# EasyEDA Pro project homeKit_HumC.eprj

# Schematic Schematic1
Create Date: 2022-08-31; Page Name: P1; Project Name: homeKit_HumC; Schematic Name: Schematic1; Update Date: 2022-09-09; Company: 嘉立创EDA
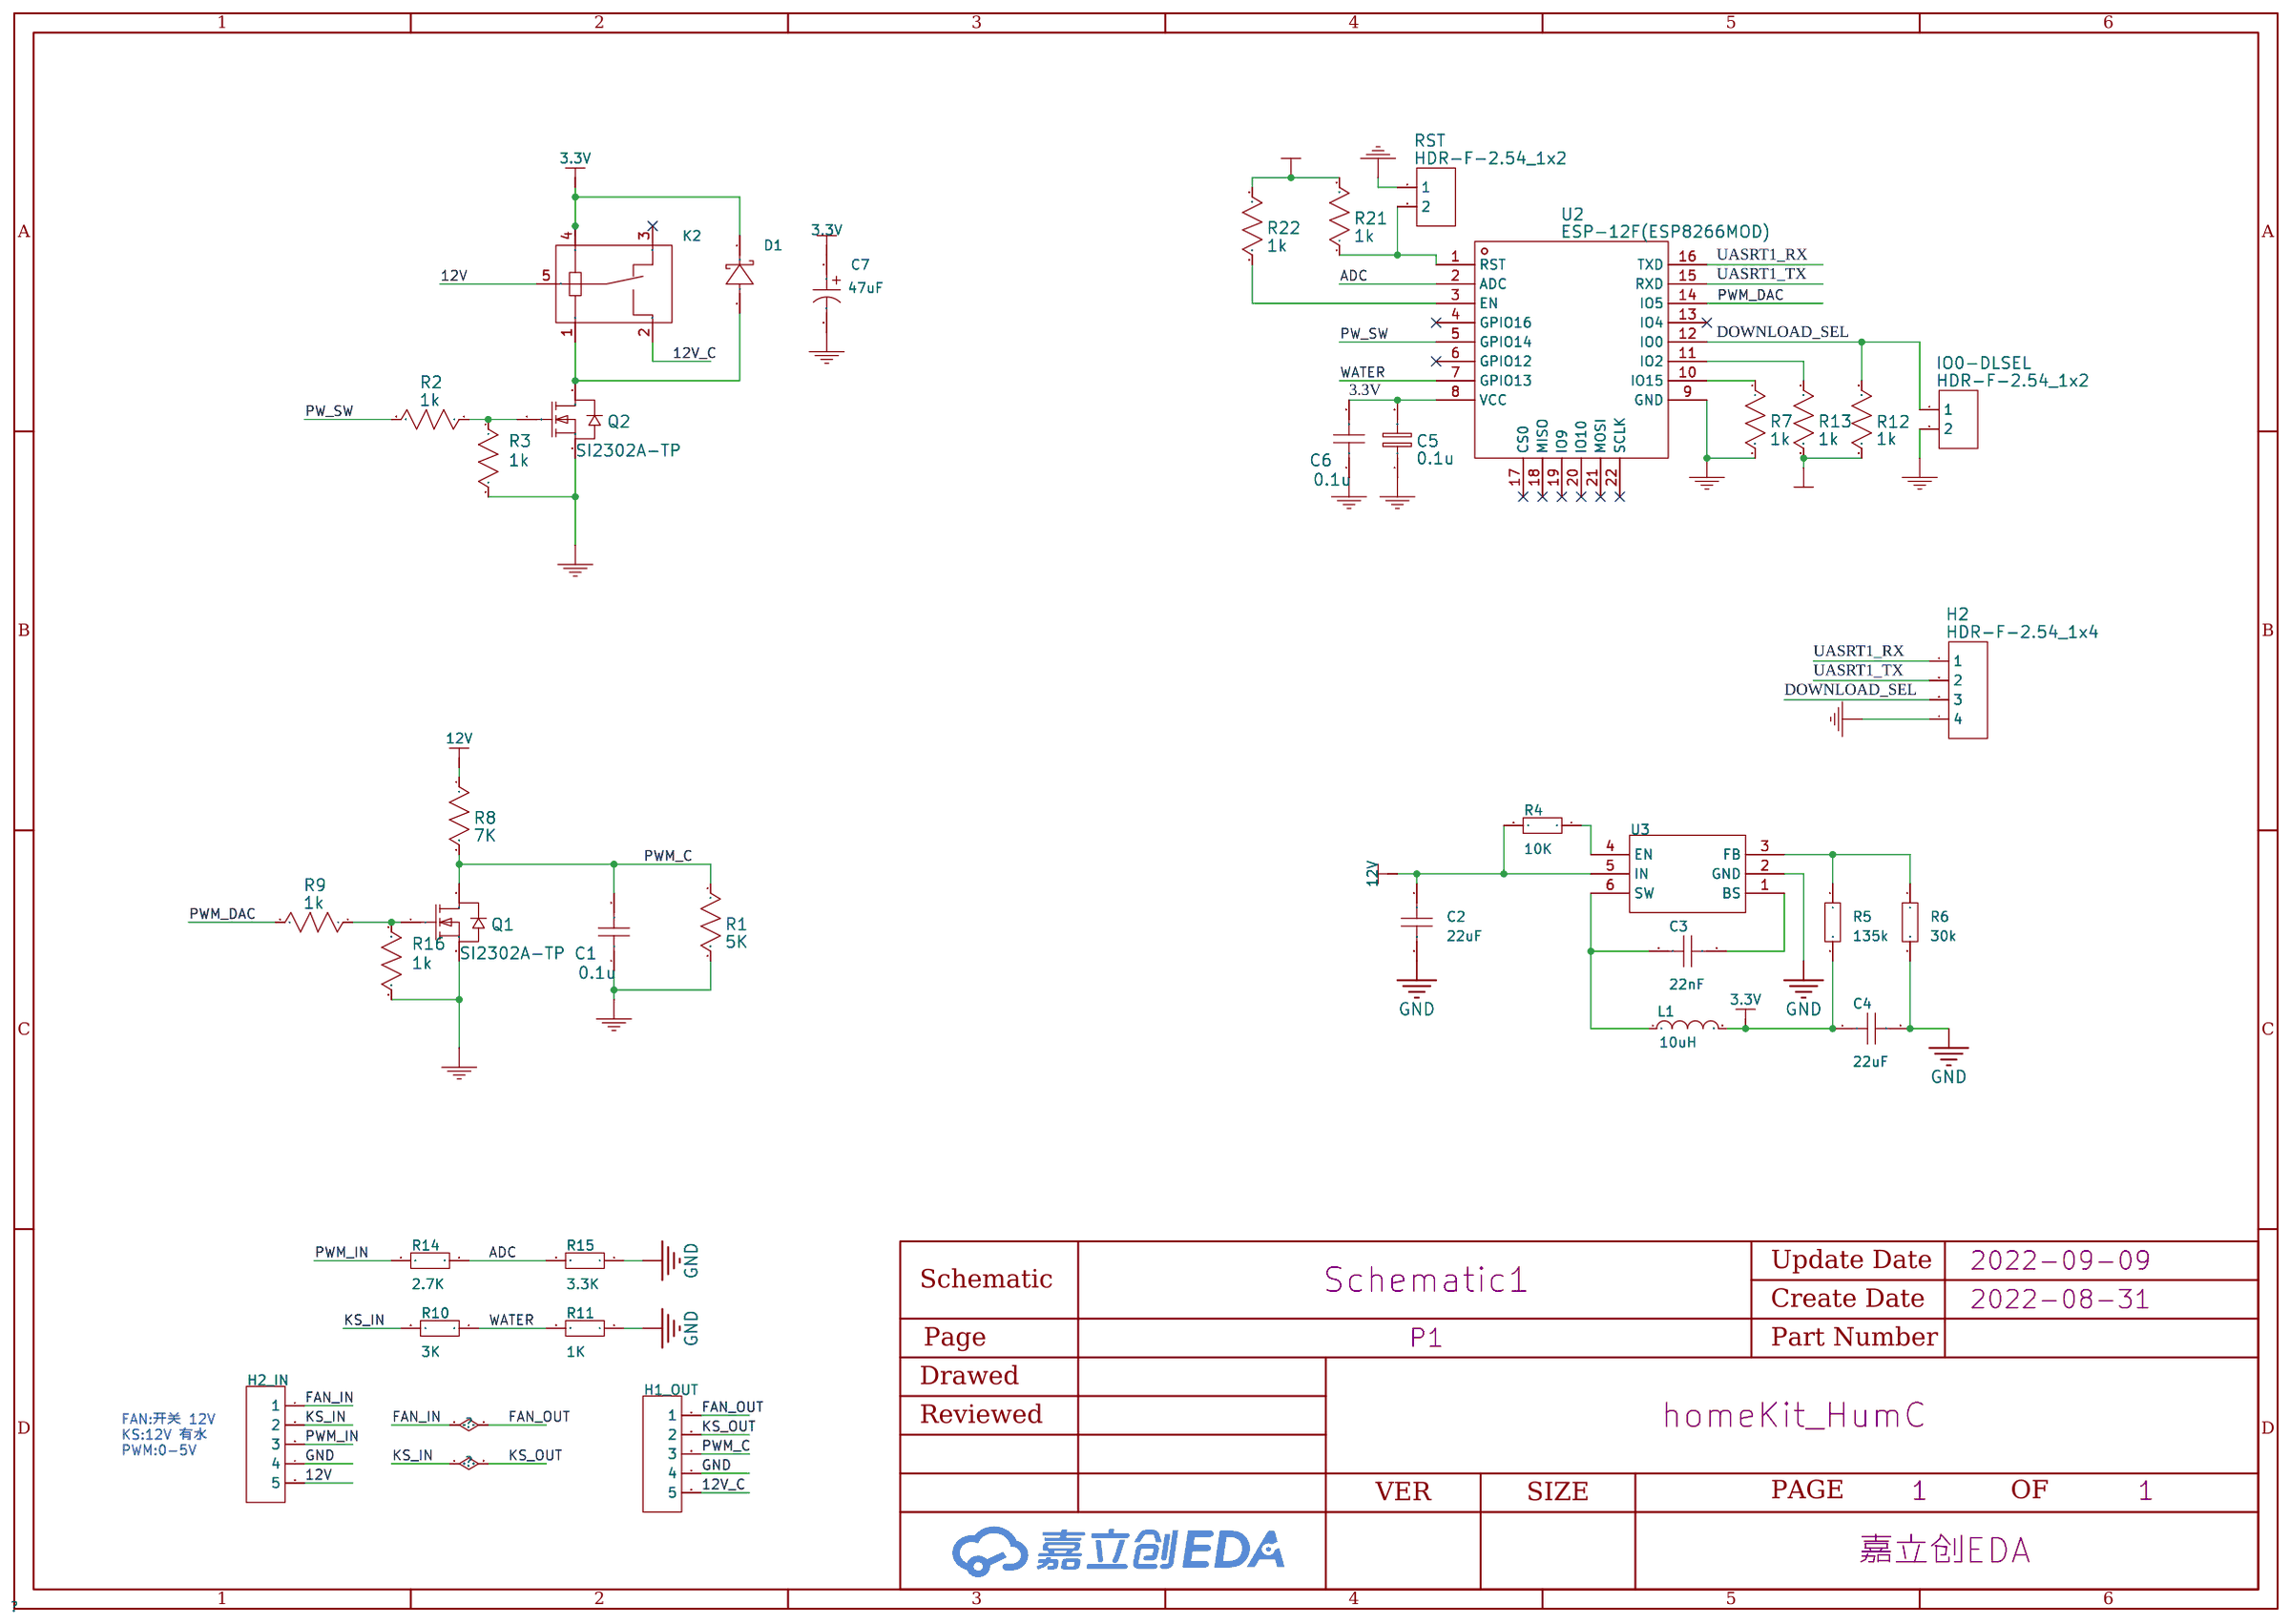
[diagram p0: schematic sheet]

## Parts
C1  0.1u  [C0805]
C2  22uF  [C0805]
C3  22nF  [C0603]
C4  22uF  [C0805]
C5  0.1u  [C0805]
C6  0.1u  [C0603]
C7  47uF  [CAP-TH_BD5.0-P2.00-D0.5-FD-1]
D1  SS34  [SMB_L4.3-W3.6-LS5.4-RD]
H1_OUT  -  [HDR-TH_5P-P2.54-V-F]
H2  HDR-F-2.54_1x4  [HDR-F-2.54_1X4]
H2_IN  -  [HDR-TH_5P-P2.54-V-F]
IO0-DLSEL  HDR-F-2.54_1x2  [HDR-F-2.54_1X2]
K2  HF3F-L/5-1ZL1T  [RELAY-TH_HF3F-L-12-1ZL1T]
L1  10uH  [IND-SMD_L7.4-W6.6]
Q1  SI2302A-TP  [SOT-23-3_L2.9-W1.3-P1.90-LS2.4-BR]
Q2  SI2302A-TP  [SOT-23-3_L2.9-W1.3-P1.90-LS2.4-BR]
R1  5K  [R0603]
R2  1k  [R0603]
R3  1k  [R0603]
R4  10K  [R0603]
R5  135k  [R0603]
R6  30k  [R0603]
R7  1k  [R0603]
R8  7K  [R0603]
R9  1k  [R0603]
R10  3K  [R0603]
R11  1K  [R0603]
R12  1k  [R0603]
R13  1k  [R0603]
R14  2.7K  [R0603]
R15  3.3K  [R0603]
R16  1k  [R0603]
R21  1k  [R0603]
R22  1k  [R0603]
RST  HDR-F-2.54_1x2  [HDR-F-2.54_1X2]
U2  ESP-12F(ESP8266MOD)  [WIFIM-SMD_ESP-12F-ESP8266MOD]
U3  MT2492  [SOT-23-6_L2.9-W1.6-P0.95-LS2.8-BR]

## Library data of the parts
C1 C5 C6 = 0.1u
C2 C4 = CAP_0805: 容值:100nF;精度:±10%;额定电压:50V;温度系数:X7R;; Supplier Footprint: 0805
C3 = CAP_0603: 容值:100nF;精度:±10%;额定电压:50V;温度系数:X7R;; Supplier Footprint: 0603
C7 = RA3-25V470ME3#-T58: 容值:47uF;精度:±20%;额定电压:25V;电容体直径:5mm;电容体长度:11mm;脚间距:2mm;纹波电流:130mA@120kHz;等效串联电阻:-;工作寿命:2000hrs@85;工作温度:-40~+85;; LCSC Part Name: 47uF ±20% 25V; Supplier Part: C2803545; Manufacturer: ELNA(伊娜); Supplier Footprint: 直插,D5xL11mm; Datasheet: https://atta.szlcsc.com/upload/public/pdf/source/20190620/C399580_30DA3C9088583F927B075350470E24E5.pdf; Supplier: LCSC; Tolerance: ±20%; Rated Voltage: 25V; φD: 5mm; L: 11mm; Lead Spacing: 2mm; Ripple Current: 130mA@120kHz; Lifetime @ Temp: 2000hrs@85; Operating Temperature: -40~+85
D1 = SS34_2: 二极管配置:-;直流反向耐压(Vr):40V;平均整流电流(Io):3A;正向压降(Vf):550mV@3A;反向电流(Ir):200uA@40V;; LCSC Part Name: 40V 3A 550mV@3A SMB; Supplier Part: C2758511; Manufacturer: UMW(友台半导体); Supplier Footprint: SMB; JLCPCB Part Class: 扩展库; Datasheet: https://atta.szlcsc.com/upload/public/pdf/source/20220418/6086AA90A55CA3573883AB8621B89826.pdf; Supplier: LCSC; Reverse Voltage (Vr): 40V; Average Rectified Current (Io): 3A; Forward Voltage (Vf@If): 550mV@3A; Reverse Leakage Current (Ir): 200uA@40V
H1_OUT H2_IN = HDR-F_2.54_1x5P: Supplier Part: C50950; Supplier Footprint: 插件
H2 = HDR-F-2.54_1x4: Supplier Part: C225501; Supplier: LCSC
IO0-DLSEL RST = HDR-F-2.54_1x2: Supplier Part: C49661; Supplier: LCSC
K2 = HF3F-L/5-1ZL1T: Supplier Part: C2690189; Manufacturer: HF(宏发); Supplier Footprint: 插件; JLCPCB Part Class: 扩展库; Datasheet: https://atta.szlcsc.com/upload/public/pdf/source/20210201/C2690189_3EE47653CE9FE2AFB2559E3194438A67.pdf; Supplier: LCSC
L1 = CKST0603-10uH/M: 电感值:10uH;精度:±20%;额定电流:4A;饱和电流(Isat):5A;直流电阻(DCR):68mΩ;; LCSC Part Name: 10uH ±20% 4A 68mΩ; Supplier Part: C3002639; Manufacturer: CENKER(岑科); Supplier Footprint: SMD,7.4x6.6x3mm; JLCPCB Part Class: 扩展库; Datasheet: https://atta.szlcsc.com/upload/public/pdf/source/20220510/B48FE89972EB9627500571FF6CB43AFA.pdf; Supplier: LCSC; Tolerance: ±20%; Rated Current: 4A; Saturation Current (Isat): 5A; DC Resistance (DCR): 68mΩ
Q1 Q2 = SI2302A-TP: Supplier: LCSC; Supplier Part: C668996; Manufacturer: MCC(Micro Commercial Components); JLCPCB Part Class: Extended Part
R1-R3 R7-R9 R12 R13 R16 R21 R22 = 1k
R4-R6 R10 R11 R14 R15 = Res_0603: Supplier Footprint: 0603
U2 = ESP-12F(ESP8266MOD): Supplier: LCSC; Manufacturer: Ai-Thinker; Supplier Part: C82891; JLCPCB Part Class: Extended Part
U3 = MT2492: 功能类型:降压型;同步整流:-;输出通道数:-;拓扑结构:-;输入电压:-;输出电流(最大值):-;开关频率:-;; LCSC Part Name: 降压型; Supplier Part: C89358; Manufacturer: 西安航天民芯; Supplier Footprint: SOT-23-6; JLCPCB Part Class: 扩展库; Datasheet: https://atta.szlcsc.com/upload/public/pdf/source/20170628/1498635304645.pdf; Supplier: LCSC; Function: 降压型

## Nets
3.3V: C4.1 C5.2 C6.2 C7.1 D1.1(K) K2.4 L1.2 R5.2 R12.1 R13.2 R21.2 R22.2 U2.8(VCC)
12V: C2.1 H2_IN.5 K2.5 R4.2 R8.1 U3.5(IN)
12V_C: H1_OUT.5 K2.2
GND: C1.1 C2.2 C4.2 C5.1 C6.1 C7.2 H1_OUT.4 H2.4 H2_IN.4 IO0-DLSEL.2 Q1.2(S) Q2.2(S) R1.2 R3.2 R6.2 R7.2 R11.1 R15.1 R16.2 RST.1 U2.9(GND) U3.2(GND)
ADC: R14.1 R15.2 U2.2(ADC)
DOWNLOAD_SEL: H2.3 IO0-DLSEL.1 R12.2 U2.12(IO0)
FAN_IN: H1_OUT.1 H2_IN.1
KS_IN: H1_OUT.2 H2_IN.2 R10.2
PW_SW: R2.2 U2.5(GPIO14)
PWM_C: C1.2 H1_OUT.3 Q1.3(D) R1.1 R8.2
PWM_DAC: R9.2 U2.14(IO5)
PWM_IN: H2_IN.3 R14.2
UASRT1_RX: H2.1 U2.16(TXD)
UASRT1_TX: H2.2 U2.15(RXD)
WATER: R10.1 R11.2 U2.7(GPIO13)
$1N1599: R4.1 U3.4(EN)
$1N2130: C3.2 L1.1 U3.6(SW)
$1N2166: C3.1 U3.1(BS)
$1N2356: R5.1 R6.1 U3.3(FB)
$1N4413: R7.1 U2.10(IO15)
$1N4419: R21.1 RST.2 U2.1(RST)
$1N4420: R22.1 U2.3(EN)
$1N4422: R13.1 U2.11(IO2)
$1N6965: Q1.1(G) R9.1 R16.1
$1N12731: Q2.1(G) R2.1 R3.1
$1N13895: D1.2(A) K2.1 Q2.3(D)

Not connected (* = marked no-connect by the designer): K2 3*; U2 4(GPIO16)* 6(GPIO12)* 13(IO4)* 17(CS0)* 18(MISO)* 19(IO9)* 20(IO10)* 21(MOSI)* 22(SCLK)*

## Notes on the sheet
- FAN:开关 12V
  KS:12V 有水
  PWM:0-5V

# Board PCB1
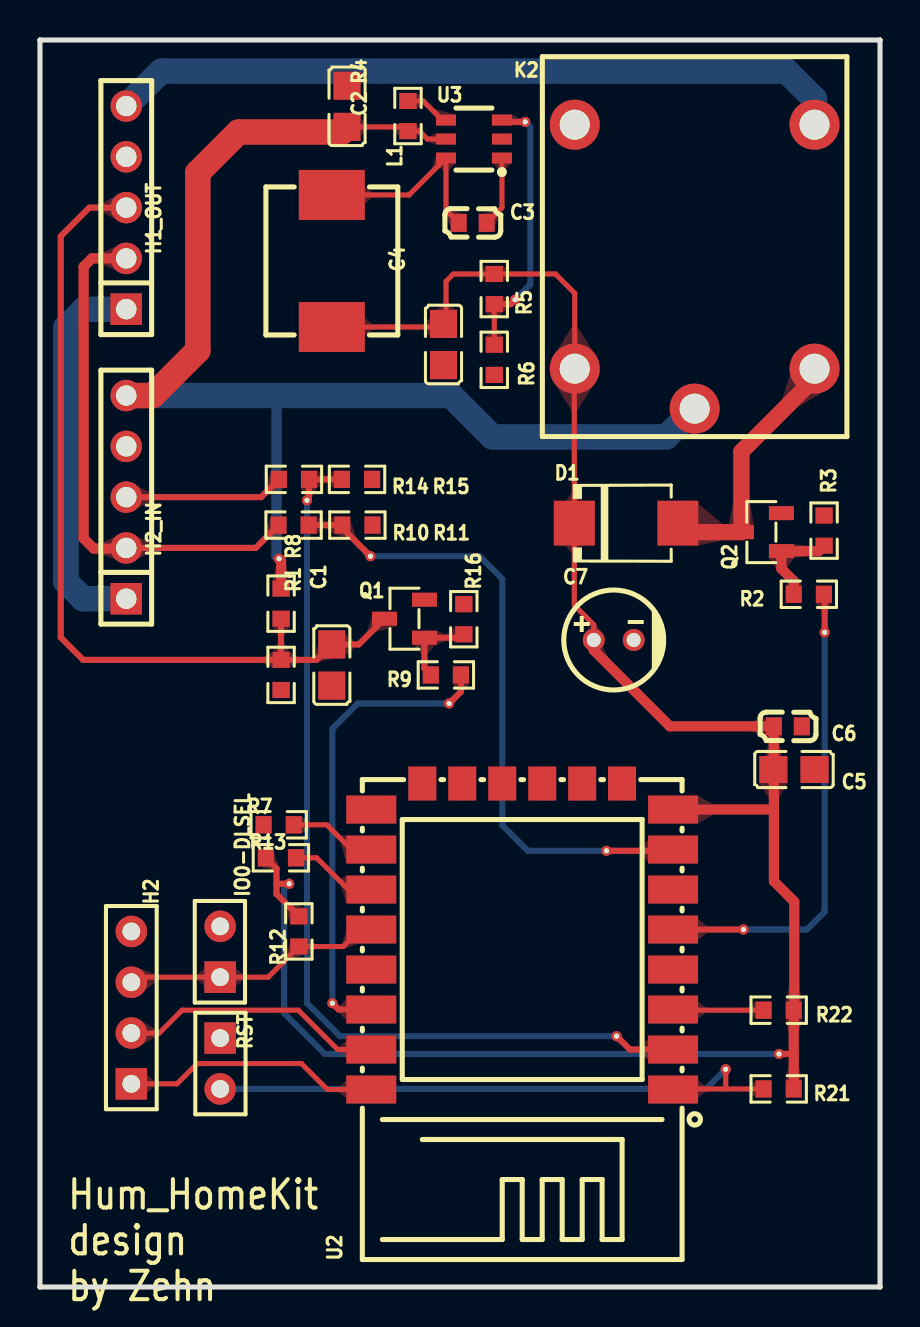
[diagram p1: board, top side]
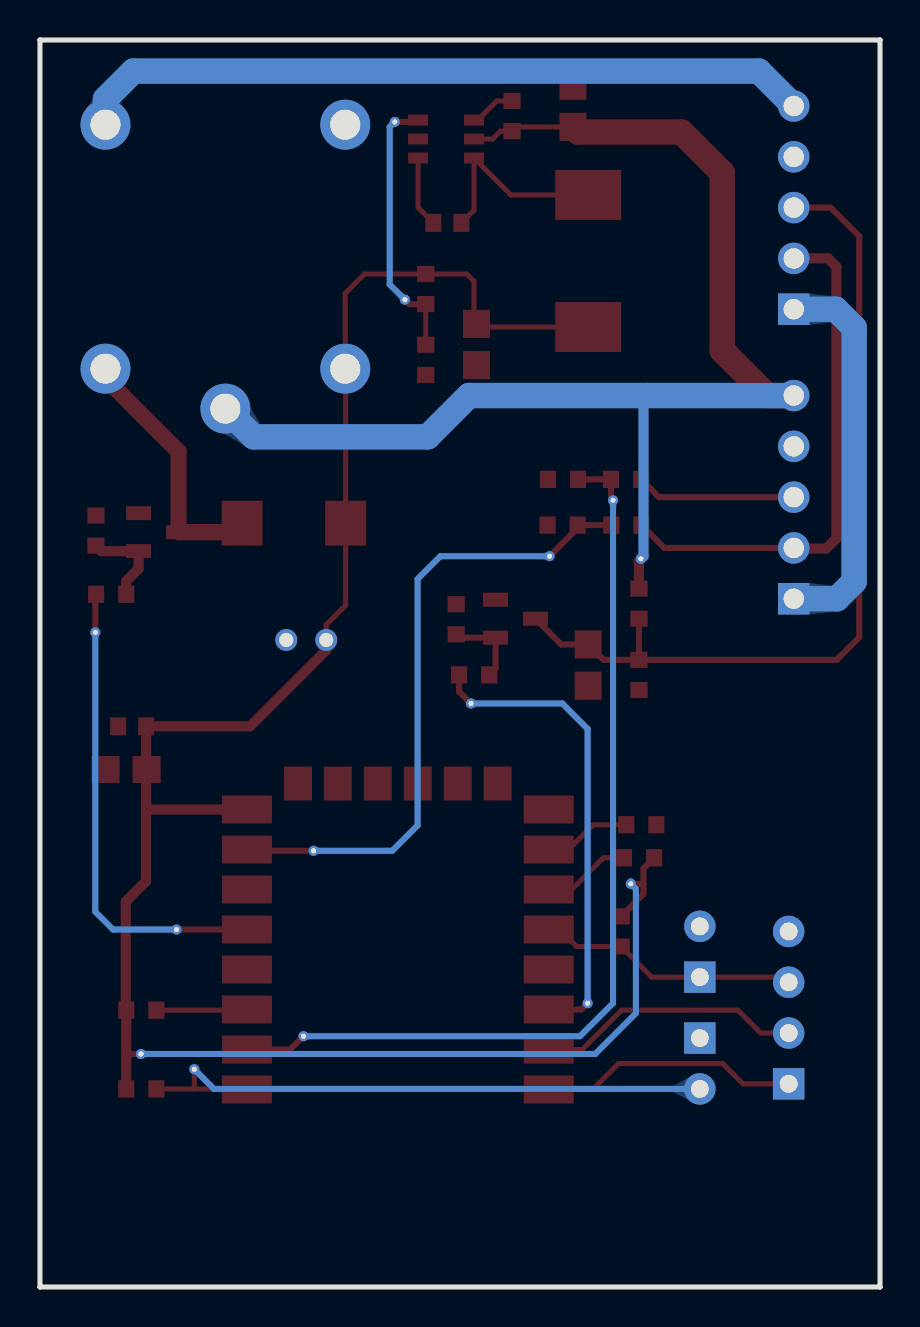
[diagram p2: board, bottom side, seen from below]

Outline 42.04 x 62.36 mm; copper layers: Top Layer, Bottom Layer. Coordinates in mm from the lower left corner of the outline.
Outline path: 0,62.35 0,0 arc(0,0) 0,0 42.03,0 arc(42.04,0) 42.04,0 42.04,62.35 arc(42.04,62.36) 42.03,62.36 0,62.36 arc(0,62.36) 0,62.35
Stack: Top Layer 0.035mm / Dielectric1 1.51mm FR4 er 4.5 / Bottom Layer 0.035mm

## Design rules (mm)
spacing safeClearance (default): track to track 0.152, other pairs 0.152 to 0.3
track width trackWidth (default): min 0.127, default 0.254, max 2.54
differential pair differentialPair (default): width min 0.127, default 0.254, max 2.54; gap min 0.152, default 0.152
via viaSize (default): diameter min 0.5, default 0.61, max 10; hole min 0.3, default 0.305, max 6
net 12V uses power
net GND uses GND
net $1N2166 uses power
net $1N1599 uses power
pour e104 uses GND

## Placement (name value [footprint] x y rotation side)
C1  0.1u  [C0805]  14.61 31.1 90 top
C2  22uF  [C0805]  15.37 59.04 90 top
C3  22nF  [C0603]  21.65 53.21 180 top
C4  22uF  [C0805]  20.19 47.13 270 top
C5  0.1u  [C0805]  37.73 25.88 180 top
C6  0.1u  [C0603]  37.42 28.04 180 top
C7  47uF  [CAP-TH_BD5.0-P2.00-D0.5-FD-1]  28.71 32.35 0 top
D1  SS34  [SMB_L4.3-W3.6-LS5.4-RD]  29.33 38.2 0 top
H1_OUT  -  [HDR-TH_5P-P2.54-V-F]  4.32 53.98 90 top
H2  HDR-F-2.54_1x4  [HDR-F-2.54_1X4]  4.57 13.97 90 top
H2_IN  -  [HDR-TH_5P-P2.54-V-F]  4.32 39.5 90 top
IO0-DLSEL  HDR-F-2.54_1x2  [HDR-F-2.54_1X2]  9.02 16.76 90 top
K2  HF3F-L/5-1ZL1T  [RELAY-TH_HF3F-L-12-1ZL1T]  32.76 51.02 90 top
L1  10uH  [IND-SMD_L7.4-W6.6]  14.61 51.31 270 top
NOREF  -  [Pad_e838]  11.96 36.42 0 top
NOREF#2  -  [Pad_e771]  36.98 11.65 0 top
NOREF#3  -  [Pad_e41]  20.47 29.18 0 top
NOREF#4  -  [Pad_e12]  24.28 58.26 0 top
NOREF#5  -  [Pad_e3]  23.77 49.37 0 top
NOREF#6  -  [Pad_e35]  14.63 14.19 0 top
NOREF#7  -  [Pad_e898]  28.85 12.54 0 top
NOREF#8  -  [Pad_e607]  12.47 20.16 0 top
NOREF#9  -  [Pad_e949]  39.27 32.73 0 top
NOREF#10  -  [Pad_e944]  35.2 17.88 0 top
NOREF#11  -  [Pad_e50]  16.54 36.54 0 top
NOREF#12  -  [Pad_e57]  28.35 21.81 0 top
NOREF#13  -  [Pad_e865]  34.32 10.89 0 top
NOREF#14  -  [Pad_e889]  13.36 39.34 0 top
Q1  SI2302A-TP  [SOT-23-3_L2.9-W1.3-P1.90-LS2.4-BR]  18.24 33.42 0 top
Q2  SI2302A-TP  [SOT-23-3_L2.9-W1.3-P1.90-LS2.4-BR]  36.1 37.75 0 top
R1  5K  [R0603]  12.07 30.61 270 top
R2  1k  [R0603]  38.47 34.64 0 top
R3  1k  [R0603]  39.24 37.82 90 top
R4  10K  [R0603]  18.42 58.56 270 top
R5  135k  [R0603]  22.73 49.9 90 top
R6  30k  [R0603]  22.73 46.36 270 top
R7  1k  [R0603]  11.95 23.11 180 top
R8  7K  [R0603]  12.07 34.17 270 top
R9  1k  [R0603]  20.31 30.61 0 top
R10  3K  [R0603]  12.69 38.1 180 top
R11  1K  [R0603]  15.88 38.1 180 top
R12  1k  [R0603]  12.95 17.78 270 top
R13  1k  [R0603]  12.06 21.46 180 top
R14  2.7K  [R0603]  12.71 40.39 180 top
R15  3.3K  [R0603]  15.87 40.39 180 top
R16  1k  [R0603]  21.21 33.39 90 top
R21  1k  [R0603]  36.97 9.91 0 top
R22  1k  [R0603]  36.97 13.84 0 top
RST  HDR-F-2.54_1x2  [HDR-F-2.54_1X2]  9.02 11.18 270 top
U2  ESP-12F(ESP8266MOD)  [WIFIM-SMD_ESP-12F-ESP8266MOD]  24.13 17.53 90 top
U3  MT2492  [SOT-23-6_L2.9-W1.6-P0.95-LS2.8-BR]  21.72 57.4 0 top

## Footprints (pads in the part's own frame, mm; a bottom-side part is the same pattern mirrored in y, then rotated)
C0603
  rect 0.8x0.9 smd: 1(-0.7,0) 2(0.7,0)
C0805
  rect 1.41x1.35 smd: 1(-1.03,0) 2(1.03,0)
CAP-TH_BD5.0-P2.00-D0.5-FD-1
  round 1.1 hole 0.7: 1(-1,0) 2(1,0)
HDR-F-2.54_1X2
  rect 1.575x1.575 hole 0.889: 1(-1.27,0)
  round 1.575 hole 0.889: 2(1.27,0)
HDR-F-2.54_1X4
  rect 1.575x1.575 hole 0.889: 1(-3.81,0)
  round 1.575 hole 0.889: 2(-1.27,0) 3(1.27,0) 4(3.81,0)
HDR-TH_5P-P2.54-V-F
  rect 1.575x1.575 hole 1.02: 1(-5.08,0)
  round 1.575 hole 1.02: 2(-2.54,0) 3(0,0) 4(2.54,0) 5(5.08,0)
IND-SMD_L7.4-W6.6
  rect 2.499x3.3 smd: 1(-3.302,0) 2(3.302,0)
Pad_e3
  round 0.508 hole 0.254: 1(0,0)
Pad_e12
  round 0.508 hole 0.254: 2(0,0)
Pad_e35
  round 0.508 hole 0.254: 3(0,0)
Pad_e41
  round 0.508 hole 0.254: 4(0,0)
Pad_e50
  round 0.508 hole 0.254: 5(0,0)
Pad_e57
  round 0.508 hole 0.254: 6(0,0)
Pad_e607
  round 0.508 hole 0.254: 1(0,0)
Pad_e771
  round 0.508 hole 0.254: 2(0,0)
Pad_e838
  round 0.508 hole 0.254: 3(0,0)
Pad_e865
  round 0.508 hole 0.254: 4(0,0)
Pad_e889
  round 0.508 hole 0.254: 5(0,0)
Pad_e898
  round 0.508 hole 0.254: 6(0,0)
Pad_e944
  round 0.508 hole 0.254: 7(0,0)
Pad_e949
  round 0.508 hole 0.254: 8(0,0)
R0603
  rect 0.806x0.864 smd: 1(-0.753,0) 2(0.753,0)
RELAY-TH_HF3F-L-12-1ZL1T
  round 2.499 hole 1.501: 1(-5.101,-6) 2(7.099,-6) 3(7.099,6) 4(-5.101,6) 5(-7.099,0)
SMB_L4.3-W3.6-LS5.4-RD
  rect 2.047x2.241 smd: 1(-2.591,0) 2(2.591,0)
SOT-23-3_L2.9-W1.3-P1.90-LS2.4-BR
  rect 1.25x0.7 smd: 1(1,-0.95) 2(1,0.95) 3(-1,0)
SOT-23-6_L2.9-W1.6-P0.95-LS2.8-BR
  rect 1x0.55 smd: 1(1.4,-0.95) 2(1.4,0) 3(1.4,0.95) 4(-1.4,0.95) 5(-1.4,0) 6(-1.4,-0.95)
WIFIM-SMD_ESP-12F-ESP8266MOD
  rect 1.399x2.499 smd: 1(-7.651,-7.551) 2(-5.652,-7.551) 3(-3.65,-7.551) 4(-1.651,-7.551) 5(0.35,-7.551) 6(2.349,-7.551) 7(4.348,-7.551) 8(6.35,-7.551) 9(6.35,7.549) 10(4.348,7.551) 11(2.349,7.551) 12(0.35,7.551) 13(-1.651,7.549) 14(-3.65,7.551) 15(-5.652,7.551) 16(-7.651,7.551)
  rect 1.7x1.399 smd: 17(7.651,-4.998) 18(7.648,-3.002) 19(7.651,-1.004) 20(7.651,0.998) 21(7.651,2.997) 22(7.651,4.996)

## Nets
3.3V: C4.1 C5.2 C6.2 C7.1 D1.1 K2.4 L1.2 NOREF#2.2 NOREF#8.1 R5.2 R12.1 R13.2 R21.2 R22.2 U2.8
12V: C2.1 H2_IN.5 K2.5 NOREF.3 R4.2 R8.1 U3.5
12V_C: H1_OUT.5 K2.2
GND: C1.1 C2.2 C4.2 C5.1 C6.1 C7.2 H1_OUT.4 H2.4 H2_IN.4 IO0-DLSEL.2 Q1.2 Q2.2 R1.2 R3.2 R6.2 R7.2 R11.1 R15.1 R16.2 RST.1 U2.9 U3.2
ADC: NOREF#7.6 NOREF#14.5 R14.1 R15.2 U2.2
DOWNLOAD_SEL: H2.3 IO0-DLSEL.1 R12.2 U2.12
FAN_IN: H1_OUT.1 H2_IN.1
KS_IN: H1_OUT.2 H2_IN.2 R10.2
PW_SW: NOREF#9.8 NOREF#10.7 R2.2 U2.5
PWM_C: C1.2 H1_OUT.3 Q1.3 R1.1 R8.2
PWM_DAC: NOREF#3.4 NOREF#6.3 R9.2 U2.14
PWM_IN: H2_IN.3 R14.2
UASRT1_RX: H2.1 U2.16
UASRT1_TX: H2.2 U2.15
WATER: NOREF#11.5 NOREF#12.6 R10.1 R11.2 U2.7
$1N1599: R4.1 U3.4
$1N2130: C3.2 L1.1 U3.6
$1N2166: C3.1 U3.1
$1N2356: NOREF#4.2 NOREF#5.1 R5.1 R6.1 U3.3
$1N4413: R7.1 U2.10
$1N4419: NOREF#13.4 R21.1 RST.2 U2.1
$1N4420: R22.1 U2.3
$1N4422: R13.1 U2.11
$1N6965: Q1.1 R9.1 R16.1
$1N12731: Q2.1 R2.1 R3.1
$1N13895: D1.2 K2.1 Q2.3

Pads without a net: K2 3; U2 4 6 13 17 18 19 20 21 22

## Routing (per net, layer and track width the routed paths; a pad name or vN(x,y) marks a point on that pad's centre or on a via; arc(x,y) is an arc through that point)
3.3V: length 104.6
  Top Layer w0.254: C7.1 27.71,33.12 26.74,34.09 D1.1 26.74,45.9 K2.4 26.76,49.69 25.8,50.66 R5.2 20.68,50.66 20.32,50.29 20.32,48.29 C4.1 20.04,48.01 L1.2
  Top Layer w0.305: NOREF#8.1 11.86,20.16 11.84,20.18 ; 11.84,20.18 11.84,20.93 R13.2 ; 11.84,20.18 11.84,19.65 12.95,18.54 ; NOREF#2.2 37.68,11.65 37.72,11.61
  Top Layer w0.508: U2.8 36.61,23.88 36.67,23.95 ; R21.2 R22.2 37.74,13.87 37.74,19.27 36.73,20.29 36.73,23.89 36.67,23.95 ; 36.67,23.95 36.73,24 C6.2 31.52,28.04 27.71,31.85 C7.1
  Bottom Layer w0.305: 12.47,20.29 NOREF#8.1 12.22,19.91 12.22,13.68 14.25,11.65 NOREF#2.2
12V: length 66.7
  Top Layer w0.254: U3.5 19.39,57.4 18.99,57.8 R4.2 18.21,58.01 C2.1
  Top Layer w0.508: NOREF.3 12.07,36.32 R8.1
  Top Layer w1.27: H2_IN.5 5.64,44.58 7.9,46.83 7.9,55.72 9.93,57.75 15.11,57.75 C2.1
  Bottom Layer w0.508: NOREF.3 11.84,36.54 11.84,44.42 11.68,44.58
  Bottom Layer w1.27: H2_IN.5 20.57,44.58 22.63,42.51 31.35,42.51 32.76,43.92
12V_C: length 37
  Bottom Layer w1.27: H1_OUT.5 6.06,60.8 37.36,60.8 38.76,59.41 K2.2
ADC: length 47.2
  Top Layer w0.305: U2.2 29.52,11.87 NOREF#7.6 ; NOREF#14.5 13.46,39.44 R14.1 R15.2
  Bottom Layer w0.305: NOREF#7.6 15.01,12.54 13.36,14.19 NOREF#14.5
DOWNLOAD_SEL: length 13.1
  Top Layer w0.254: H2.3 4.83,15.49 IO0-DLSEL.1 11.42,15.49 R12.2 15.18,17.03 16.03,17.88 U2.12
FAN_IN: length 19.5
  Bottom Layer w1.27: H1_OUT.1 2.22,48.9 1.3,47.97 1.3,35.27 2.15,34.42 H2_IN.1
KS_IN: length 26.3
  Top Layer w0.305: R10.2 10.8,36.96 H2_IN.2
  Top Layer w0.508: H1_OUT.2 2.6,51.44 2.18,51.02 2.18,37.43 2.69,36.93 4.29,36.93 H2_IN.2
PW_SW: length 23.8
  Top Layer w0.305: NOREF#9.8 39.27,34.6 R2.2 ; U2.5 35.2,17.88
  Bottom Layer w0.305: NOREF#9.8 39.27,18.76 38.38,17.88 NOREF#10.7
PWM_C: length 43.5
  Top Layer w0.305: R1.1 13.83,31.36 C1.2 15.95,32.13 Q1.3 ; R1.1 2.16,31.36 1.04,32.48 1.04,52.55 2.47,53.98 H1_OUT.3 ; R1.1 R8.2
PWM_DAC: length 23.7
  Top Layer w0.305: 21.06,30.61 21.06,29.77 NOREF#3.4 ; 14.76,14.07 14.95,13.88 U2.14
  Bottom Layer w0.305: NOREF#6.3 14.63,27.91 15.9,29.18 NOREF#3.4
PWM_IN: length 8
  Top Layer w0.305: H2_IN.3 11.07,39.5 11.96,40.39
UASRT1_RX: length 13
  Top Layer w0.254: U2.16 14.38,9.88 13.08,11.18 7.87,11.18 6.86,10.16 H2.1
UASRT1_TX: length 13.3
  Top Layer w0.254: H2.2 5.97,12.7 7.11,13.84 12.93,13.84 14.9,11.87 U2.15
WATER: length 32.3
  Top Layer w0.305: NOREF#12.6 31.62,21.81 U2.7 ; 13.44,38.1 R11.2 15.13,37.95 NOREF#11.5
  Bottom Layer w0.305: NOREF#12.6 24.41,21.81 23.14,23.08 23.14,35.4 22,36.54 NOREF#11.5
$1N1599: length 2.3
  Top Layer w0.254: R4.1 19.18,59.31 20.13,58.35 U3.4
$1N2130: length 10
  Top Layer w0.254: L1.1 18.47,54.61 U3.6 20.32,53.85 C3.2
$1N2166: length 3.6
  Top Layer w0.254: U3.1 23.12,53.98 C3.1
$1N2356: length 13.5
  Top Layer w0.254: R5.1 R6.1
  Top Layer w0.305: R5.1 23.55,49.15 23.65,49.24 ; NOREF#4.2 23.21,58.26 U3.3
  Bottom Layer w0.305: NOREF#5.1 24.54,50.13 24.54,58.01 NOREF#4.2
$1N4413: length 4.4
  Top Layer w0.254: U2.10 15.59,21.87 14.35,23.11 R7.1
$1N4419: length 31.3
  Top Layer w0.254: R21.1 34.32,9.91 ; 34.32,9.91 31.68,9.91 U2.1 ; 34.32,9.91 NOREF#13.4
  Bottom Layer w0.305: NOREF#13.4 33.33,9.91 RST.2
$1N4420: length 4.6
  Top Layer w0.254: R22.1 31.68,13.84 U2.3
$1N4422: length 4.4
  Top Layer w0.254: U2.11 15.43,19.88 13.84,21.46 R13.1
$1N6965: length 4
  Top Layer w0.305: R9.1 19.24,30.93 Q1.1 21.04,32.47 R16.1
$1N12731: length 4.7
  Top Layer w0.508: R2.1 37.72,35.3 37.1,35.92 Q2.1 38.96,36.8 R3.1
$1N13895: length 13.1
  Top Layer w0.813: D1.2 32.37,37.75 Q2.3 35.1,41.78 38.76,45.43 K2.1

## Copper pours and planes (outline as drawn; the poured copper is in the pictures)
3.3V on Top Layer: 23.27,50.13 24.03,50.13 24.66,49.5 24.66,39.97 25.17,39.47 25.17,33.12 30.76,27.53 34.87,27.53 35.97,26.43 35.97,26.38 37.31,26.38 37.43,26.5 37.43,27.25 37.11,27.57 37.11,28.67 36.73,29.05 31.78,29.05 28.6,32.14 28.6,32.86 27.59,33.88 27.51,44.22 28.22,44.93 28.22,47.09 27.58,47.72 27.58,49.12 25.69,51.02 23.25,51.02 23.25,50.15
3.3V on Top Layer: 12.95,49.28 19.18,49.28 20.07,50.17 20.07,50.67 20.51,51.12 23.39,51.12 23.49,51.02 23.49,50.22 23.39,50.12 21.41,50.12 21.34,50.04 21.34,47.5 21.21,47.37 17.53,47.37 16.76,46.61 12.95,46.61
12V on Top Layer: 14.19,58.64 13.97,58.42 13.97,57.02 14.22,56.77 18.92,56.77 19.18,57.02 20.7,57.02 20.83,57.15 20.83,57.66 19.56,57.66 18.92,58.29 16.62,58.29 16.27,58.64
GND on Top Layer: 0.03,60.8 0.03,1.75 1.68,0.1 40.67,0.1 41.94,1.37 41.94,60.8 40.41,62.33 1.55,62.33
GND on Bottom Layer: 0.03,60.8 0.03,1.75 1.68,0.1 40.67,0.1 41.94,1.37 41.94,60.8 40.41,62.33 1.55,62.33
$1N1599 on Top Layer: 17.91,59.69 17.91,58.93 18.03,58.8 19.18,58.8 19.94,58.04 20.83,58.04 20.83,58.67 20.7,58.8 20.32,58.8 19.3,59.82 18.03,59.82
$1N2130 on Top Layer: 12.95,55.88 18.92,55.88 19.81,56.77 20.83,56.77 20.95,56.64 20.95,54.36 21.37,53.94 21.37,52.71 13.46,52.71 12.95,53.21
$1N2166 on Top Layer: 21.95,52.73 21.97,52.71 23.11,52.71 23.37,52.96 23.37,55.88 23.62,56.13 23.62,56.77 22.61,56.77 22.51,56.67 22.51,54.38 21.95,53.82

Small or netless copper shapes (teardrops, artwork), in the pictures only: 104 on Top Layer, 18 on Bottom Layer

## Text on the board
Top Silkscreen Layer: Hum_HomeKit / design / by Zehn
